# EAGLE schematic Hocki-Control (EAGLE 9.5.2)
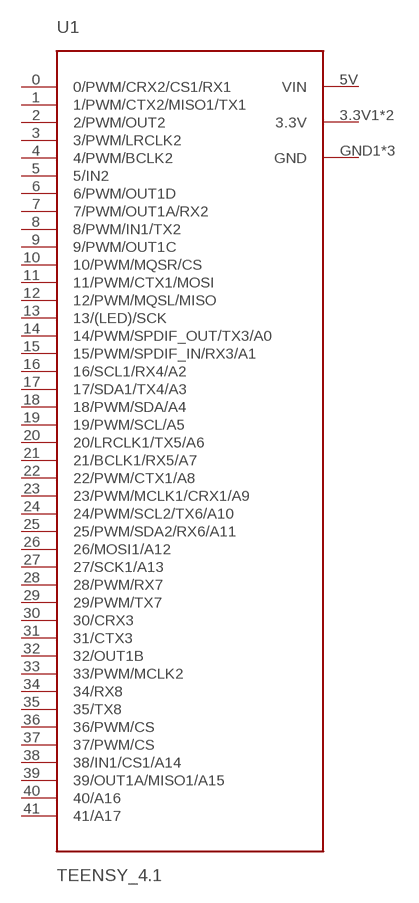
[diagram p0: schematic, sheet 1]

## Parts
U1  TEENSY_4.1  [TEENSY_4.1]
Unconnected: U1.0(0/PWM/CRX2/CS1/RX1) U1.1(1/PWM/CTX2/MISO1/TX1) U1.2(2/PWM/OUT2) U1.3(3/PWM/LRCLK2) U1.3.3V1(3.3V) U1.3.3V2(3.3V) U1.4(4/PWM/BCLK2) U1.5(5/IN2) U1.5V(VIN) U1.6(6/PWM/OUT1D) U1.7(7/PWM/OUT1A/RX2) U1.8(8/PWM/IN1/TX2) U1.9(9/PWM/OUT1C) U1.10(10/PWM/MQSR/CS) U1.11(11/PWM/CTX1/MOSI) U1.12(12/PWM/MQSL/MISO) U1.13(13/(LED)/SCK) U1.14(14/PWM/SPDIF_OUT/TX3/A0) U1.15(15/PWM/SPDIF_IN/RX3/A1) U1.16(16/SCL1/RX4/A2) U1.17(17/SDA1/TX4/A3) U1.18(18/PWM/SDA/A4) U1.19(19/PWM/SCL/A5) U1.20(20/LRCLK1/TX5/A6) U1.21(21/BCLK1/RX5/A7) U1.22(22/PWM/CTX1/A8) U1.23(23/PWM/MCLK1/CRX1/A9) U1.24(24/PWM/SCL2/TX6/A10) U1.25(25/PWM/SDA2/RX6/A11) U1.26(26/MOSI1/A12) U1.27(27/SCK1/A13) U1.28(28/PWM/RX7) U1.29(29/PWM/TX7) U1.30(30/CRX3) U1.31(31/CTX3) U1.32(32/OUT1B) U1.33(33/PWM/MCLK2) U1.34(34/RX8) U1.35(35/TX8) U1.36(36/PWM/CS) U1.37(37/PWM/CS) U1.38(38/IN1/CS1/A14) U1.39(39/OUT1A/MISO1/A15) U1.40(40/A16) U1.41(41/A17) U1.GND1(GND) U1.GND2(GND) U1.GND3(GND)

## Library data of the parts
U1 = Hocki_library:TEENSY_4.1: Teensy 4.1 features the fastest micocontroller and an expanded set of powerful peripherals in a 2.4 by 0.7 inch form factor. DigiKey <https://www.digikey.com/product-detail/en/sparkfun-electronics/DEV-16771/1568-DEV-16771-ND/12180099>; DKPN: 1568-DEV-16771-ND